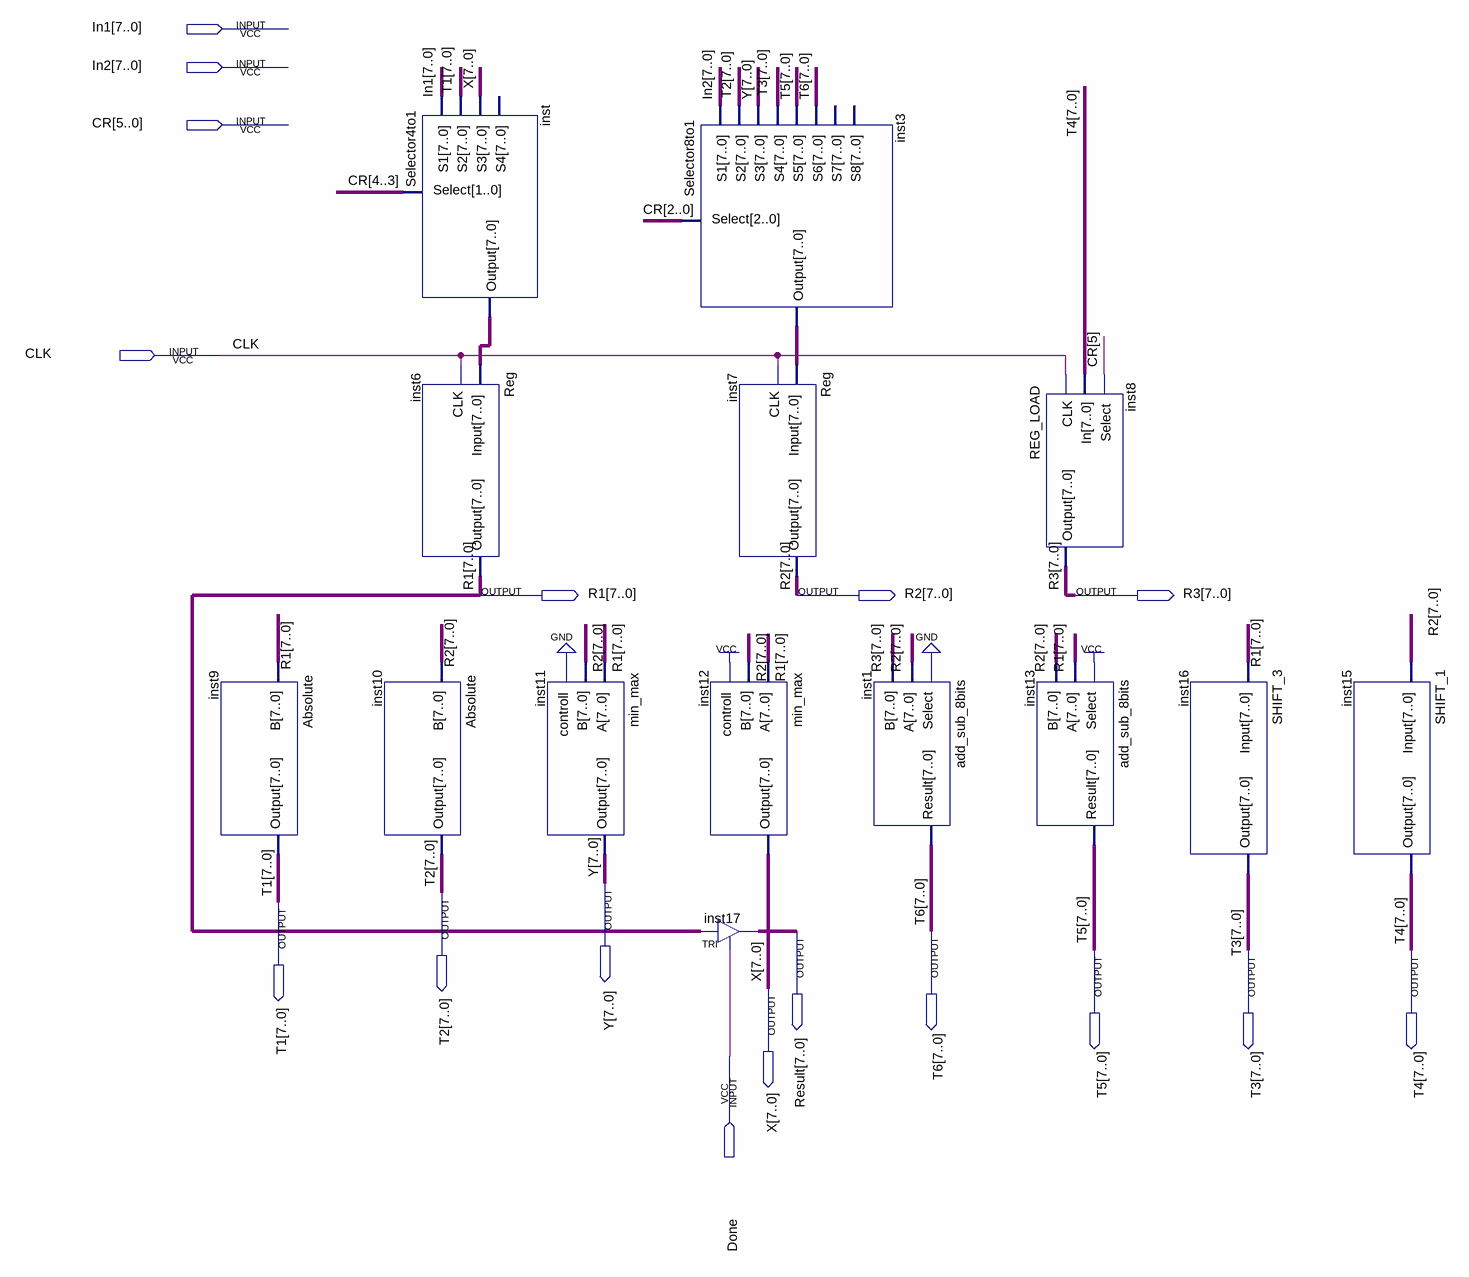
[diagram p0: schematic sheet]
// Quartus schematic Datapath_version2.bdf as structural Verilog: 14 symbols, 17 pins
module Datapath_version2 (
  input  [7:0] In1,
  input  [7:0] In2,
  input  [5:0] CR,
  input  CLK,
  input  Done,
  output [7:0] R1,
  output [7:0] R2,
  output [7:0] R3,
  output [7:0] Y,
  output [7:0] T2,
  output [7:0] T1,
  output [7:0] Result,
  output [7:0] T6,
  output [7:0] T5,
  output [7:0] T3,
  output [7:0] T4,
  output [7:0] X
);

  wire [7:0] inst3_output, inst_output;

  Absolute inst9 (.B(R1), .Output(T1));
  Absolute inst10 (.B(R2), .Output(T2));
  Selector4to1 inst (.S1(In1), .S2(T1), .S3(X), .Select(CR[4:3]), .Output(inst_output));  // open: S4
  Reg inst6 (.Input(inst_output), .CLK(CLK), .Output(R1));
  min_max inst11 (.A(R1), .B(R2), .controll(1'b0), .Output(Y));
  Selector8to1 inst3 (
    .S1(In2), .S2(T2), .S3(Y), .S4(T3), .S5(T5), .S6(T6), .Select(CR[2:0]), .Output(inst3_output));  // open: S7, S8
  min_max inst12 (.A(R1), .B(R2), .controll(1'b1), .Output(X));
  TRI inst17[7:0] (.IN(R1), .OE(Done), .OUT(Result));
  Reg inst7 (.Input(inst3_output), .CLK(CLK), .Output(R2));
  add_sub_8bits inst1 (.Select(1'b0), .A(R2), .B(R3), .Result(T6));
  REG_LOAD inst8 (.CLK(CLK), .In(T4), .Select(CR[5]), .Output(R3));
  add_sub_8bits inst13 (.Select(1'b1), .A(R1), .B(R2), .Result(T5));
  SHIFT_3 inst16 (.Input(R1), .Output(T3));
  SHIFT_1 inst15 (.Input(R2), .Output(T4));
endmodule
